# EAGLE design LPC_Gira (EAGLE 5.02)
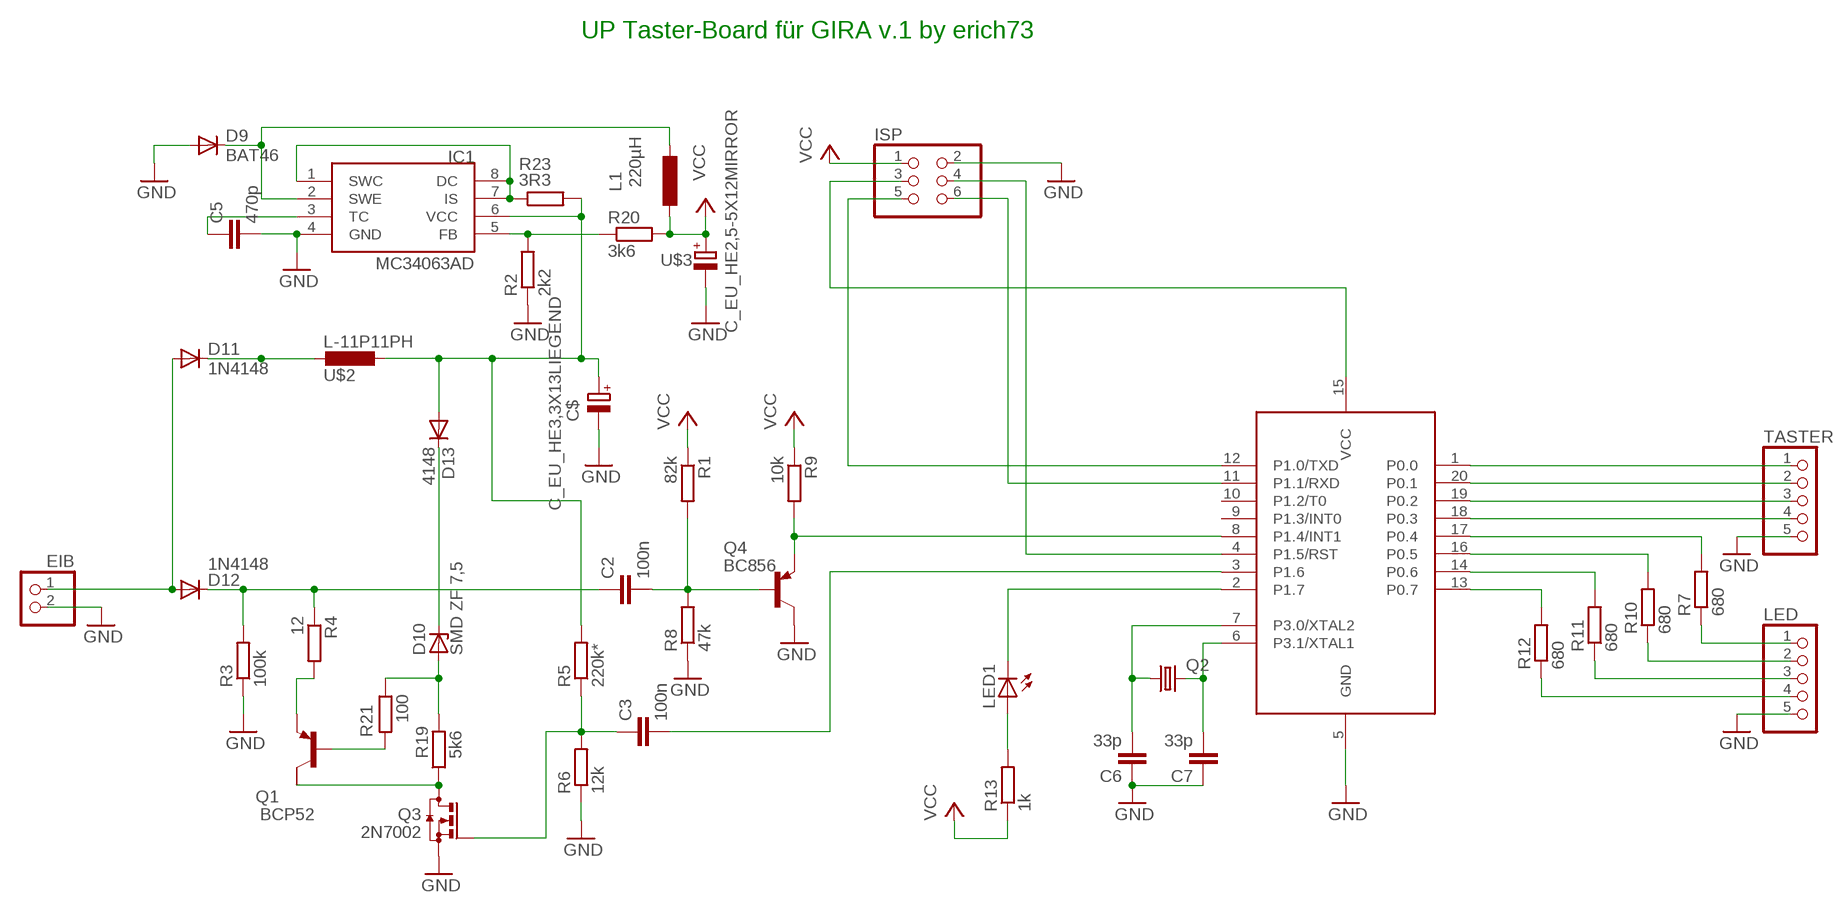
[diagram p0: schematic, sheet 1]

## Parts
C2  100n  C-EUC1206  [C1206]
C3  100n  C-EUC1206  [C1206]
C5  470p  C-EUC1206  [C1206]
C6  33p  C-EUC0805  [C0805]
C7  33p  C-EUC0805  [C0805]
C$  C_EU_HE3,3X13LIEGEND  [E3,3-7,5X13]
D9  BAT46  DIODE-MINIMELF  [MINIMELF]
D10  SMD ZF 7,5  ZPD  [MINIMELF]
D11  1N4148  DIODE-MINIMELF  [MINIMELF]
D12  1N4148  DIODE-MINIMELF  [MINIMELF]
D13  4148  DIODE-MINIMELF  [MINIMELF]
EIB  PINHD-1X2  [1X02]
IC1  MC34063AD  [SOIC8]
ISP  PINHD-2X3  [2X03]
L1  220µH  L-EU2200-15.24  [2200-15.24]
LED  PINHD-1X5  [1X05]
LED1  LED3MM  [LED3MM]
Q1  BCP52  FZT753SMD  [SOT223]
Q2  CRYSTAL_CRYSTALHC49S  [CRYSTAL_HC49/S]
Q3  2N7002  BSS123  [SOT23]
Q4  BC856  BC856ALT1SMD  [SOT23-BEC]
R1  82k  R-EU_R1206  [R1206]
R2  2k2  R-EU_R1206  [R1206]
R3  100k  R-EU_M1206  [M1206]
R4  12  R-EU_R1206  [R1206]
R5  220k*  R-EU_R1206  [R1206]
R6  12k  R-EU_M1206  [M1206]
R7  680  R-EU_R1206  [R1206]
R8  47k  R-EU_M1206  [M1206]
R9  10k  R-EU_R1206  [R1206]
R10  680  R-EU_R1206  [R1206]
R11  680  R-EU_R1206  [R1206]
R12  680  R-EU_R1206  [R1206]
R13  1k  R-EU_M1206  [M1206]
R19  5k6  R-EU_M1206  [M1206]
R20  3k6  R-EU_M1206  [M1206]
R21  100  R-EU_R1206  [R1206]
R23  3R3  R-EU_M1206  [M1206]
TASTER  PINHD-1X5  [1X05]
U$2  L-11P11PH  [11PH]
U$3  C_EU_HE2,5-5X12MIRROR  [E2,5-5X12MIRR]
U$4  LPC922FDH  [TSSOP20]

## Nets
GND: C5.2 C6.1 C7.1 C$.- D9.A EIB.2 IC1.4(GND) ISP.2 LED.5 Q3.2(S) Q4.C R2.1 R3.1 R6.1 R8.1 TASTER.5 U$3.- U$4.5(GND)
N$1: ISP.3 U$4.15(VCC)
N$2: ISP.4 U$4.4(P1.5/RST)
N$3: ISP.5 U$4.12(P1.0/TXD)
N$4: ISP.6 U$4.11(P1.1/RXD)
N$5: C7.2 Q2.2 U$4.6(P3.1/XTAL1)
N$6: C6.2 Q2.1 U$4.7(P3.0/XTAL2)
N$7: TASTER.1 U$4.1(P0.0)
N$8: TASTER.2 U$4.20(P0.1)
N$9: TASTER.3 U$4.19(P0.2)
N$10: TASTER.4 U$4.18(P0.3)
N$11: R7.2 U$4.17(P0.4)
N$12: C$.+ D13.A IC1.6(VCC) R5.2 R23.2 U$2.P$1
N$13: LED.1 R7.1
N$14: R10.2 U$4.16(P0.5)
N$15: R11.2 U$4.14(P0.6)
N$16: R12.2 U$4.13(P0.7)
N$17: LED.2 R10.1
N$18: LED.3 R11.1
N$19: Q4.E R9.2 U$4.8(P1.4/INT1)
N$20: LED.4 R12.1
N$21: LED1.K(C) U$4.2(P1.7)
N$22: LED1.A R13.2
N$23: C2.2 Q4.B R1.2 R8.2
N$24: C3.2 U$4.3(P1.6)
N$25: C2.1 D12.C R3.2 R4.1
N$26: IC1.5(FB) R2.2 R20.1
N$27: D9.C IC1.2(SWE) L1.2
N$28: C5.1 IC1.3(TC)
N$34: C3.1 Q3.1(G) R5.1 R6.2
N$36: D11.C U$2.P$2
N$37: Q1.2(C) Q3.3(D) R19.1
N$38: D10.A R19.2 R21.1
N$39: Q1.3(E) R4.2
N$40: Q1.1(B) R21.2
N$41: D10.C D13.C
N$51: D11.A D12.A EIB.1
N$61: IC1.1(SWC) IC1.7(IS) IC1.8(DC) R23.1
VCC: ISP.1 L1.1 R1.1 R9.1 R13.1 R20.2 U$3.+
Unconnected: Q1.4(C/) U$4.9(P1.3/INT0) U$4.10(P1.2/T0)

## Notes on the sheet
- UP Taster-Board für GIRA v.1 by erich73

## Library data of the parts
C2 C3 C5-C7 = rcl:C-EU: CAPACITOR, European symbol
C$ U$3 = rcl:C_EU_H
D9 D11-D13 = diode:DIODE-: DIODE
D10 = diode:ZPD: Z DIODE 500 mW
EIB = pinhead:PINHD-1X2: PIN HEADER
IC1 = mc34063:MC34063
ISP = pinhead:PINHD-2X3: PIN HEADER
L1 = rcl:L-EU: INDUCTOR, European symbol
LED TASTER = pinhead:PINHD-1X5: PIN HEADER
LED1 = led:LED: LED OSRAM: - CHIPLED LG R971, LG N971, LY N971, LG Q971, LY Q971, LO R971, LY R971 LH N974, LH R974 LS Q976, LO Q976, LY Q976 LO Q996 - Hyper CHIPLED LW Q18S LB Q993, LB Q99A, LB R99A - SideLED LS A670, LO A670, LY A670, LG A670, LP A670 LB A673, LV A673, LT A673, LW A673 LH A674 LY A675 LS A676, LA A676, LO A676, LY A676, LW A676 LS A679, LY A679, LG A679 - Hyper Micro SIDELED® LS Y876, LA Y876, LO Y876, LY Y876 LT Y87S - SmartLED LW L88C, LW L88S LB L89C, LB L89S, LG L890 LS L89K, LO L89K, LY L89K LS L896, LA L896, LO L896, LY L896 - TOPLED LS T670, LO T670, LY T670, LG T670, LP T670 LSG T670, LSP T670, LSY T670, LOP T670, LYG T670 LG T671, LOG T671, LSG T671 LB T673, LV T673, LT T673, LW T673 LH T674 LS T676, LA T676, LO T676, LY T676, LB T676, LH T676, LSB T676, LW T676 LB T67C, LV T67C, LT T67C, LS T67K, LO T67K, LY T67K, LW E67C LS E67B, LA E67B, LO E67B, LY E67B, LB E67C, LV E67C, LT E67C LW T67C LS T679, LY T679, LG T679 LS T770, LO T770, LY T770, LG T770, LP T770 LB T773, LV T773, LT T773, LW T773 LH T774 LS E675, LA E675, LY E675, LS T675 LS T776, LA T776, LO T776, LY T776, LB T776 LHGB T686 LT T68C, LB T68C - Hyper Mini TOPLED® LB M676 - Mini TOPLED Santana® LG M470 LS M47K, LO M47K, LY M47K Source: http://www.osram.convergy.de - LUMILED® LXK2-PW12-R00, LXK2-PW12-S00, LXK2-PW14-U00, LXK2-PW14-V00 LXK2-PM12-R00, LXK2-PM12-S00, LXK2-PM14-U00 LXK2-PE12-Q00, LXK2-PE12-R00, LXK2-PE12-S00, LXK2-PE14-T00, LXK2-PE14-U00 LXK2-PB12-K00, LXK2-PB12-L00, LXK2-PB12-M00, LXK2-PB14-N00, LXK2-PB14-P00, LXK2-PB14-Q00 LXK2-PR12-L00, LXK2-PR12-M00, LXK2-PR14-Q00, LXK2-PR14-R00 LXK2-PD12-Q00, LXK2-PD12-R00, LXK2-PD12-S00 LXK2-PH12-R00, LXK2-PH12-S00 LXK2-PL12-P00, LXK2-PL12-Q00, LXK2-PL12-R00 Source: www.luxeon.com
Q1 = transistor-pnp:FZT753SMD: PNP Transistor
Q2 = LPCGira:CRYSTAL_CRYSTAL: CRYSTAL
Q3 = transistor-small-signal:BSS123: N-CHANNEL MOS FET
Q4 = transistor-pnp:BC856*: PNP Transistror
R1-R13 R19-R21 R23 = rcl:R-EU_: RESISTOR, European symbol
U$2 = rcl:L-11P
U$4 = LPCGira:LPC922FDH

## Board
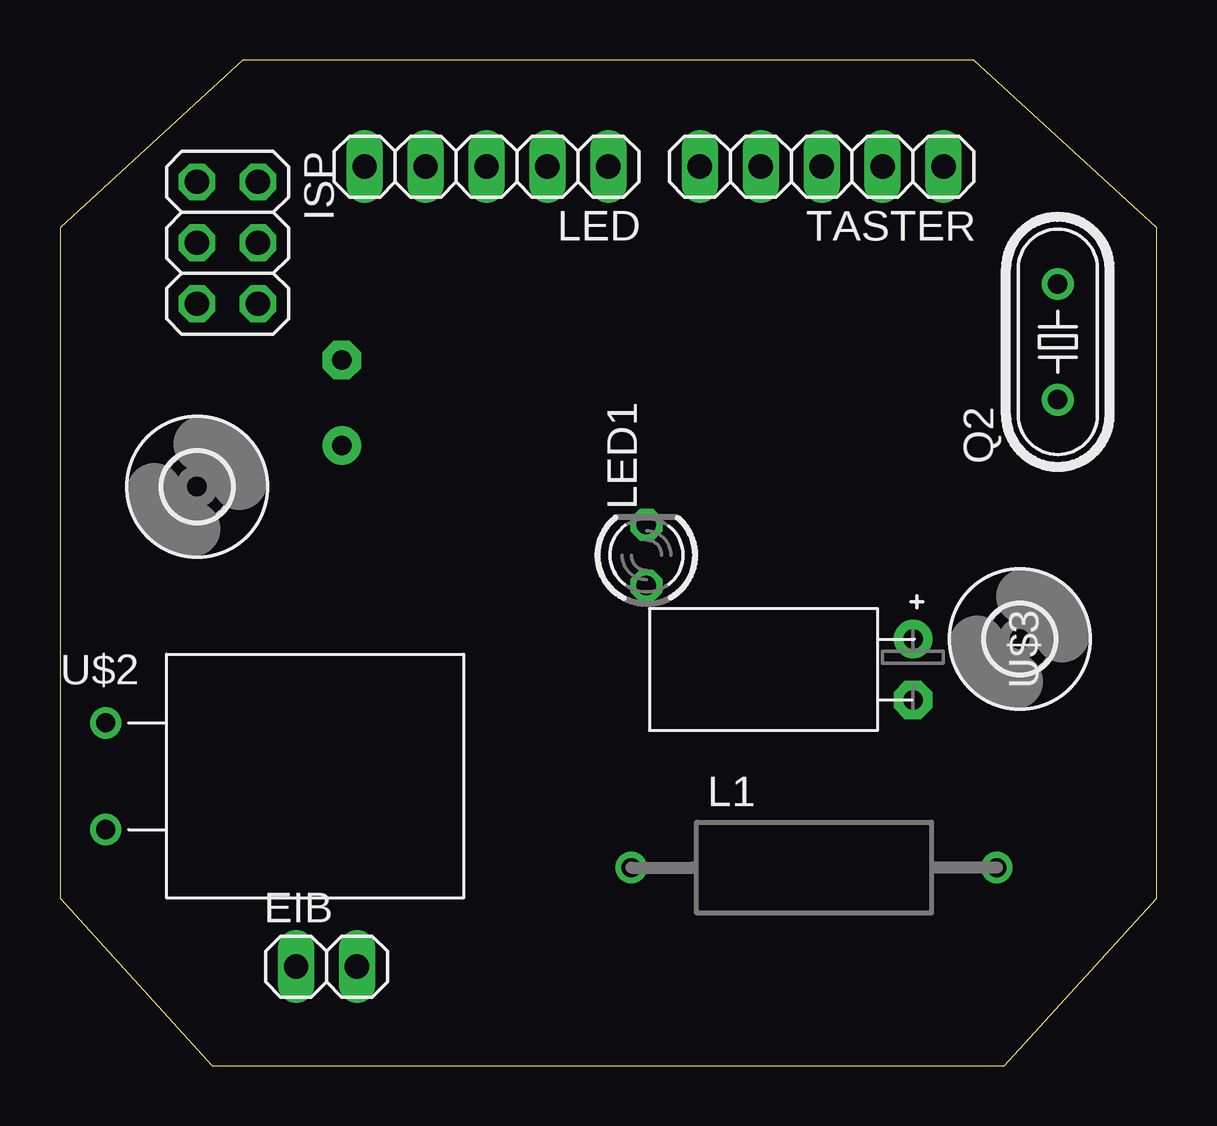
[diagram p1: board, top side]
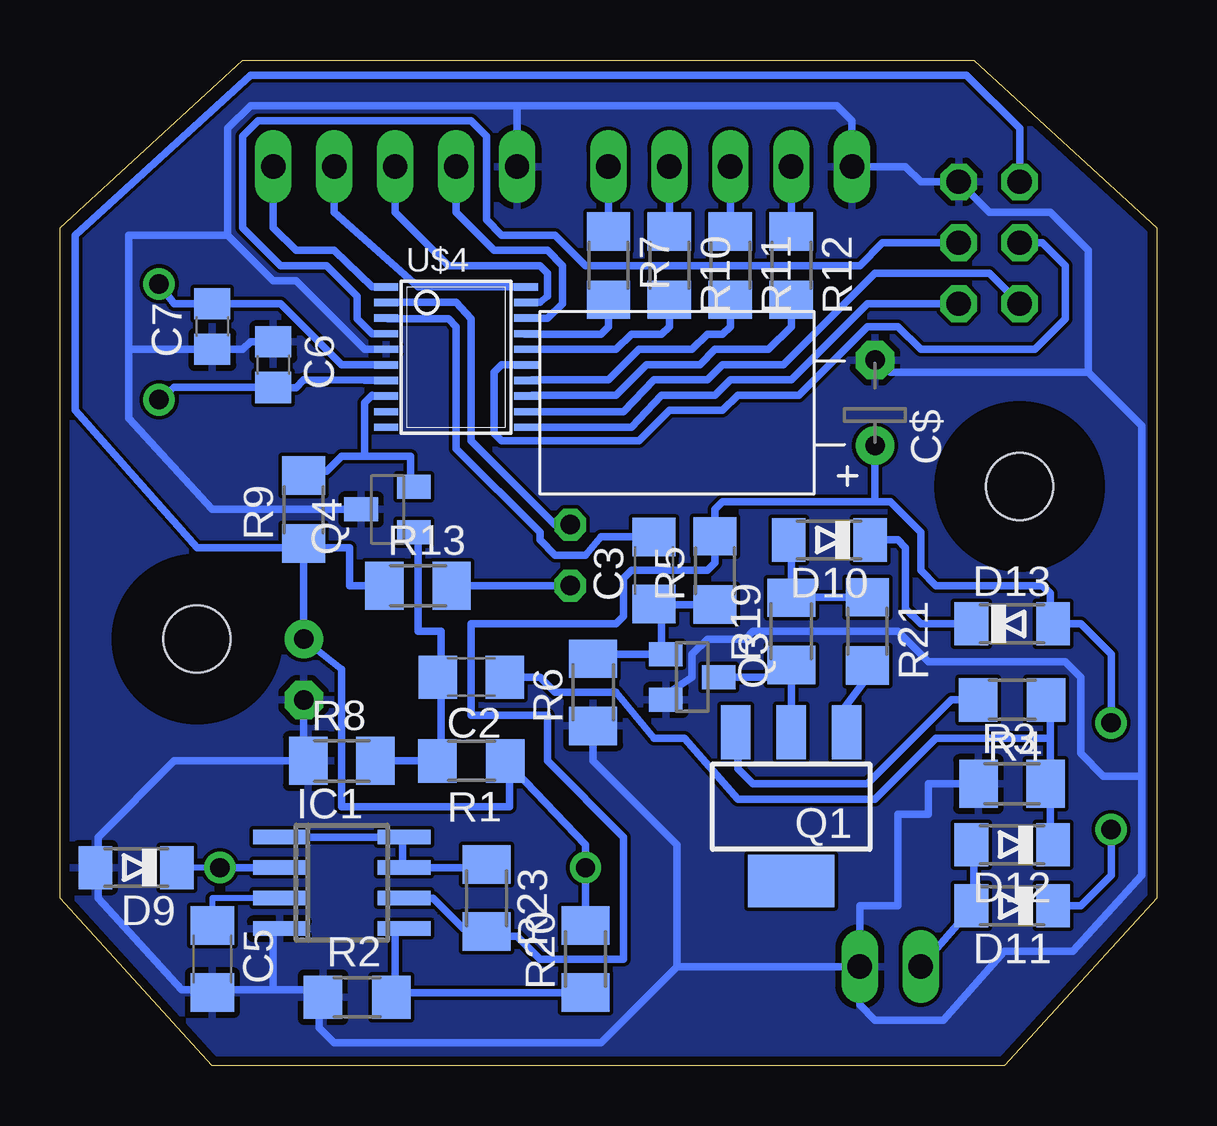
[diagram p2: board, bottom side, seen from below]

Size 45.72 x 41.9 mm. Coordinates in mm from the lower left corner, seen from the top.
Outline: 39.37,0 45.72,6.98 45.72,34.92 38.1,41.9 7.62,41.9 0,34.92 0,6.98 6.35,0 39.37,0
Copper layers (1*16): Top 0.035mm / dielectric 1.5mm / Bottom 0.035mm
Design rules "HAKA *": minimum track width 6mil, minimum drill 12mil, track to track 6mil, track to pad 6mil, pad to pad 6mil, via to via 6mil, smd to smd 8mil, copper to edge 15mil, drill to drill 8mil, minimum pad ring 10mil, minimum via ring 6mil, stop-mask expansion 4mil, vias tented up to drill 0mil, thermal gap 10mil

### Footprints (pad centres in the part's own frame; a part is rotated, then mirrored left to right if it is on the bottom)
C1206 = smd 1.6 x 1.8: 1 -1.4,0; 2 1.4,0
C0805 = smd 1.3 x 1.5: 1 -0.95,0; 2 0.95,0
E3,3-7,5X13 = drill 0.813 pad 1.6 round: + -1.778,0 | drill 0.813 pad 1.6 octagon: - 1.778,0
MINIMELF = smd 1.4 x 1.8: A 1.7,0; C -1.7,0
1X02 = drill 1.016 long: 1 -1.27,0; 2 1.27,0
SOIC8 = smd 0.6 x 2.2: 1 -1.905,-2.6; 2 -0.635,-2.6; 3 0.635,-2.6; 4 1.905,-2.6; 5 1.905,2.6; 6 0.635,2.6; 7 -0.635,2.6; 8 -1.905,2.6
2X03 = drill 1.016 octagon: 1 -2.54,-1.27; 2 -2.54,1.27; 3 0,-1.27; 4 0,1.27; 5 2.54,-1.27; 6 2.54,1.27
2200-15.24 = drill 0.8 pad 1.27 round: 1 -7.62,0; 2 7.62,0
1X05 = drill 1.016 long: 1 -5.08,0; 2 -2.54,0; 3 0,0; 4 2.54,0; 5 5.08,0
LED3MM = drill 0.813 octagon: A -1.27,0; K 1.27,0
SOT223 = smd 1.219 x 2.235: 1 -2.311,-3.099; 2 0,-3.099; 3 2.311,-3.099 | smd 3.6 x 2.2: 4 0,3.099
CRYSTAL_HC49/S = drill 0.813 round: 1 -2.413,0; 2 2.413,0
SOT23 = smd 1 x 1.4: 1 -0.95,-1.1; 2 0.95,-1.1; 3 0,1.1
SOT23-BEC = smd 1 x 1.4: B -0.95,-1.1; C 0,1.1; E 0.95,-1.1
R1206 = smd 1.6 x 1.803: 1 -1.422,0; 2 1.422,0
M1206 = smd 1.6 x 2: 1 -1.4,0; 2 1.4,0
2,8 = hole 2.8: 0,0
11PH = drill 0.8 round: P$1 -2.223,0; P$2 2.223,0
E2,5-5X12MIRR = drill 0.813 pad 1.6 round: + -1.27,0 | drill 0.813 pad 1.6 octagon: - 1.27,0
TSSOP20 = smd 0.305 x 0.991: 1 -2.925,-2.918; 2 -2.275,-2.918; 3 -1.625,-2.918; 4 -0.975,-2.918; 5 -0.325,-2.918; 6 0.325,-2.918; 7 0.975,-2.918; 8 1.625,-2.918; 9 2.275,-2.918; 10 2.925,-2.918; 11 2.925,2.918; 12 2.275,2.918; 13 1.625,2.918; 14 0.975,2.918; 15 0.325,2.918; 16 -0.325,2.918; 17 -0.975,2.918; 18 -1.625,2.918; 19 -2.275,2.918; 20 -2.925,2.918

### Placement (x,y rotation side)
C2  28.57,16.19 180 bottom
C3  20.95,20.63 90 bottom
C5  39.37,4.44 270 bottom
C6  36.83,29.2 270 bottom
C7  39.37,30.79 90 bottom
C$  11.75,27.62 90 bottom
D9  42.55,8.25 180 bottom
D10  13.65,21.9 180 bottom
D11  6.03,6.66 180 bottom
D12  6.03,9.2 180 bottom
D13  6.03,18.41 0 bottom
EIB  11.11,4.12 0 top
IC1  33.97,7.62 270 bottom
ISP  6.99,34.29 270 top
L1  31.43,8.25 0 top
LED  17.78,37.46 180 top
LED1  24.45,21.27 90 top
Q1  15.24,10.79 180 bottom
Q2  41.59,30.16 90 top
Q3  19.37,16.19 270 bottom
Q4  32.07,23.17 90 bottom
R1  28.57,12.7 180 bottom
R2  33.34,2.85 0 bottom
R3  6.03,11.74 0 bottom
R4  6.03,15.24 180 bottom
R5  18.41,20.63 90 bottom
R6  23.5,15.55 90 bottom
R7  22.86,33.33 270 bottom
R8  33.97,12.7 0 bottom
R9  35.56,23.17 90 bottom
R10  20.32,33.33 270 bottom
R11  17.78,33.33 270 bottom
R12  15.24,33.33 270 bottom
R13  30.8,20 0 bottom
R19  15.24,18.09 90 bottom
R20  23.81,4.44 90 bottom
R21  12.06,18.09 270 bottom
R23  27.94,6.98 270 bottom
TASTER  31.75,37.46 180 top
U$1  [2,8]  5.71,24.12 0 top
U$2  1.91,12.06 270 top
U$3  35.56,16.5 270 top
U$4  29.21,29.52 270 bottom
U$5  [2,8]  40.01,17.77 0 top

### Tracks (layer width: path | path; a pad name or v marks a point on that pad's centre or on a via)
GND
  Bottom 0.152: R2.1 34.29,3.17
  Bottom 0.305: 42.86,29.84 C7.1 38.1,29.84 37.78,30.15 C6.1 | 42.86,29.84 42.86,34.6 38.73,34.6 | 38.73,34.6 36.83,32.7 35.88,32.7 33.02,29.84 32.38,29.84 32.38,29.85 U$4.5 | 26.67,40 TASTER.5 | 26.67,40 37.78,40 38.73,39.05 38.73,34.6 | 26.67,40 13.34,40 12.7,39.37 LED.5 10.48,37.46 9.84,36.83 ISP.2 6.99,35.55 4.45,35.55 2.86,33.97 2.86,28.89 | 11.75,29.52 C$.- 11.11,28.89 2.86,28.89 | Q4.C 39.37,23.17 42.86,26.98 42.86,29.84 | 34.92,3.17 36.83,3.17 | 39.37,3.17 C5.2 | 36.83,3.17 39.37,3.17 | IC1.4 36.83,5.71 36.83,3.17 | 39.37,3.17 40.64,3.17 44.13,6.98 44.13,8.25 | 44.13,8.25 D9.A | 44.13,8.25 44.13,9.52 40.96,12.7 R8.1 35.56,12.7 U$3.- | Q3.2 20.32,15.24 20.32,15.55 19.37,16.19 19.37,17.14 18.73,17.77 17.14,17.77 16.83,18.09 10.79,18.09 9.53,16.82 3.81,16.82 3.17,16.19 3.17,13.01 2.22,12.06 0.64,12.06 | 0.64,12.06 0.64,26.66 2.86,28.89 | EIB.2 20,4.12 | 20,4.12 23.18,0.95 34.29,0.95 34.92,1.58 34.92,3.17 | 34.92,3.17 R2.1 | R3.1 9.53,11.74 9.53,10.47 10.79,10.47 10.79,6.66 12.38,6.66 EIB.2 | R6.1 23.5,12.7 20,9.2 20,4.12 | EIB.2 12.38,2.54 11.75,1.9 8.89,1.9 6.35,4.76 3.49,4.76 0.64,7.93 0.64,12.06
  pour Bottom: 7.62,42.22 38.1,42.22 46.04,34.92 46.04,6.66 39.37,-0.32 6.35,-0.32 -0.32,6.98 -0.32,34.92
N$1
  Bottom 0.305: U$4.15 27.3,29.2 27.62,28.89 27.62,26.35 27.3,26.03 21.59,26.03 20.32,27.3 18.1,27.3 17.46,27.93 14.92,27.93 12.06,30.79 10.79,30.79 9.84,29.84 5.08,29.84 3.81,31.11 3.81,33.33 4.76,34.29 ISP.3
N$2
  Bottom 0.305: U$4.4 32.7,30.5 33.34,31.11 33.34,32.06 34.61,33.33 36.51,33.33 38.1,34.92 38.1,38.73 37.47,39.37 28.57,39.37 27.94,38.73 27.94,35.24 27.3,34.6 25.08,34.6 23.81,33.33 12.38,33.33 11.43,34.29 ISP.4
N$3
  Bottom 0.305: U$4.12 22.23,27.25 20.95,28.57 18.73,28.57 18.1,29.2 15.56,29.2 11.75,33.02 6.99,33.02 ISP.5
N$4
  Bottom 0.305: U$4.11 21.91,26.6 20.64,27.93 18.41,27.93 17.78,28.57 15.24,28.57 12.06,31.74 ISP.6
N$5
  Bottom 0.305: U$4.6 33.97,29.2 36.51,31.74 38.73,31.74 C7.2 40.96,31.74 Q2.2
N$6
  Bottom 0.305: U$4.7 33.02,28.55 35.56,28.57 35.88,28.25 C6.2 40.96,28.25 Q2.1
N$7
  Bottom 0.305: U$4.1 32.7,32.45 34.29,33.97 35.88,33.97 36.83,34.92 TASTER.1
N$8
  Bottom 0.305: U$4.20 30.8,32.45 34.29,35.55 TASTER.2
N$9
  Bottom 0.305: U$4.19 25.72,31.8 25.4,32.06 25.4,33.02 25.72,33.33 29.53,33.33 31.75,35.55 TASTER.3
N$10
  Bottom 0.305: U$4.18 25.4,31.15 24.77,31.74 24.77,33.33 25.4,33.97 27.62,33.97 29.21,35.55 TASTER.4
N$11
  Bottom 0.305: R7.2 22.86,30.79 23.18,30.47 26.35,30.47 26.35,30.5 U$4.17
N$12
  Bottom 0.305: U$2.P$1 1.91,17.14 3.17,18.41 D13.A 4.45,17.77 4.45,19.68 4.76,20 9.21,20 9.84,20.63 9.84,22.22 11.11,23.49 11.75,23.49 | IC1.6 30.16,6.98 28.89,5.71 27.94,5.71 R23.2 27.94,5.39 26.67,5.39 25.72,4.44 22.23,4.44 22.23,9.52 25.4,12.7 25.4,14.6 28.57,14.6 28.57,18.41 22.54,18.41 22.23,18.73 22.23,20.31 21.91,20.63 18.73,20.63 18.41,20.95 R5.2 18.41,23.17 18.1,23.49 11.75,23.49 | 11.75,23.49 C$.+
N$13
  Bottom 0.305: R7.1 LED.1
N$14
  Bottom 0.305: R10.2 20.32,30.79 20.64,30.47 21.91,30.47 22.54,29.84 26.04,29.84 26.04,29.85 U$4.16
N$15
  Bottom 0.305: R11.2 17.78,30.79 18.1,30.47 18.73,30.47 19.37,29.84 21.59,29.84 22.86,28.57 26.04,28.57 26.04,28.55 U$4.14
N$16
  Bottom 0.305: R12.2 15.24,30.79 16.19,29.84 18.41,29.84 19.05,29.2 21.27,29.2 22.54,27.93 26.04,27.93 26.04,27.9 U$4.13
N$17
  Bottom 0.305: R10.1 LED.2
N$18
  Bottom 0.305: R11.1 LED.3
N$19
  Bottom 0.305: 33.02,25.39 33.97,25.39 34.61,24.76 35.56,24.76 R9.2 | U$4.8 32.7,27.9 32.7,27.93 33.02,27.62 33.02,25.39 | Q4.E 31.11,24.12 31.11,25.39 33.02,25.39
N$20
  Bottom 0.305: R12.1 LED.4
N$21
  Bottom 0.305: U$4.2 29.21,31.8 28.57,31.11 28.57,26.03 25.08,22.54 LED1.K
N$22
  Bottom 0.305: 29.53,20 R13.2 LED1.A
N$23
  Bottom 0.305: R8.2 R1.2 29.84,13.01 29.84,16.19 | 29.84,16.19 C2.2 | 29.84,16.19 29.84,18.09 30.8,18.09 30.8,22.22 Q4.B
N$24
  Bottom 0.305: C3.2 23.18,22.03 23.81,21.27 25.08,21.27 25.72,21.9 25.72,22.22 29.21,25.71 29.21,30.79 29.53,31.11 32.07,31.11 32.07,31.15 U$4.3
N$25
  Bottom 0.254: 4.45,15.55 R4.1
  Bottom 0.305: 4.45,13.65 4.45,11.43 4.45,8.89 | 4.45,13.65 4.45,15.55 | 4.45,13.65 9.21,13.65 11.75,11.11 17.46,11.11 19.68,13.65 20.95,13.65 22.54,15.55 25.08,15.55 25.72,16.19 C2.1 27.3,16.19
  Bottom 0.406: D12.C 4.45,8.89 | 4.45,11.43 R3.2
N$26
  Bottom 0.305: R20.1 31.75,3.04 31.75,2.85 | 31.75,2.85 R2.2 | IC1.5 31.75,5.71 31.75,2.85
N$27
  Bottom 0.254: L1.2 D9.C
  Bottom 0.305: IC1.2 L1.2
N$28
  Bottom 0.254: 39.37,5.71 C5.1 39.37,6.98 IC1.3
N$34
  Bottom 0.305: 23.18,17.14 R6.2 | 23.18,17.14 Q3.1 20.64,17.14 20.64,19.23 C3.1 20.95,19.21 | 23.18,17.14 | 20.95,19.21 R5.1 | 20.95,19.21 20.95,19.04
N$36
  Bottom 0.305: D11.C 3.17,6.66 1.91,7.93 U$2.P$2
N$37
  Bottom 0.305: Q1.2 15.24,16.5 | 15.24,16.5 R19.1 | Q3.3 15.24,16.19 15.24,16.5
N$38
  Bottom 0.305: 15.24,19.51 R19.2 15.24,21.9 D10.A | R21.1 15.24,19.51 | 15.24,19.51 15.24,19.68
N$39
  Bottom 0.305: R4.2 8.57,15.24 12.06,11.74 16.83,11.74 17.46,12.38 17.46,13.89 | 17.46,13.89 17.46,13.97 | 17.46,13.89 Q1.3
N$40
  Bottom 0.305: R21.2 12.06,16.19 13.02,14.92 13.02,13.89 Q1.1
N$41
  Bottom 0.305: D13.C 9.84,18.41 10.48,19.04 10.48,21.58 10.79,21.9 D10.C
N$51
  Bottom 0.305: EIB.1 7.62,6.66 | D12.A 7.62,8.89 7.62,6.66 | 7.62,6.66 D11.A
N$61
  Bottom 0.305: IC1.1 IC1.8 31.43,9.52 31.43,8.25 IC1.7 27.94,8.25 R23.1
VCC
  Bottom 0.305: R20.2 L1.1 23.81,9.2 R1.1 26.99,12.38 26.99,10.79 33.97,10.79 33.97,16.5 U$3.+ 35.56,21.58 | 35.56,21.58 40.01,21.58 45.09,27.3 45.09,34.6 37.78,41.27 7.94,41.27 5.71,39.05 ISP.1 | R13.1 33.66,20 33.66,21.58 35.56,21.58 | 35.56,21.58 R9.1